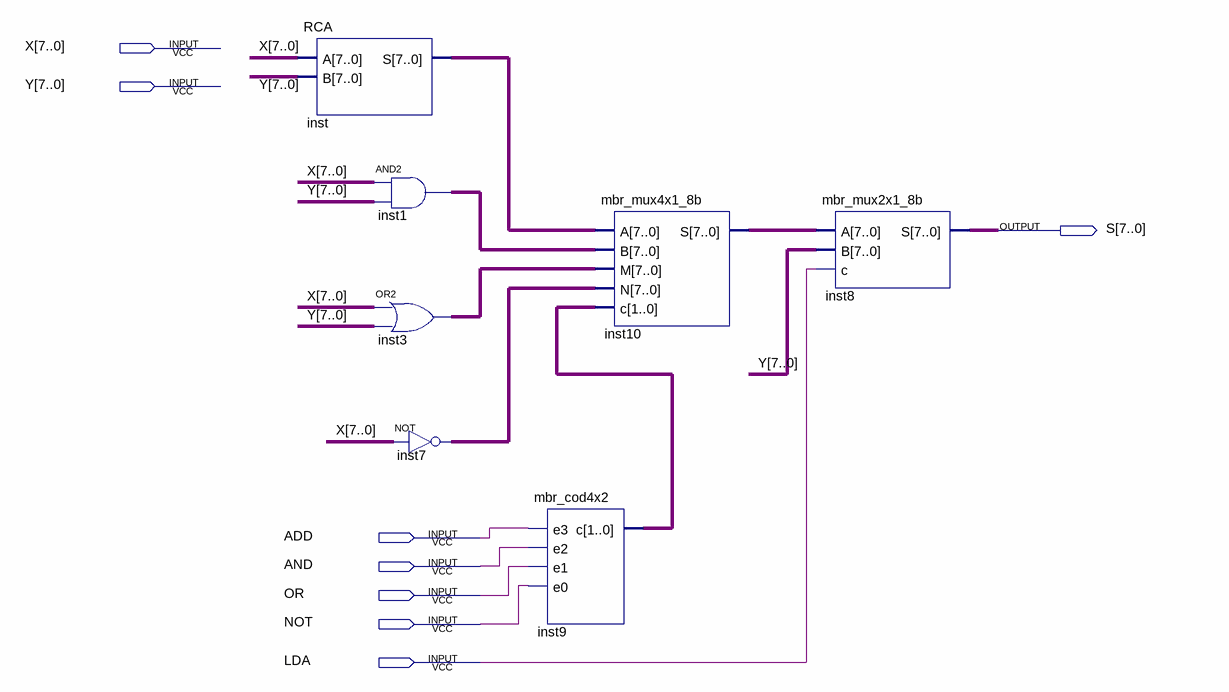
[diagram p0: schematic sheet]
// Quartus schematic mbr_ula.bdf as structural Verilog: 7 symbols, 8 pins
module mbr_ula (
  input  [7:0] X,
  input  [7:0] Y,
  input  ADD,
  input  AND,
  input  OR,
  input  NOT,
  input  LDA,
  output [7:0] S
);

  wire [1:0] inst9_c;
  wire [7:0] inst1_out, inst3_out, inst7_out, inst10_s, inst_s;

  RCA inst (.A(X), .B(Y), .S(inst_s));
  assign inst1_out = X & Y;  // AND2 inst1, 8 bits wide
  assign inst3_out = X | Y;  // OR2 inst3, 8 bits wide
  assign inst7_out = ~X;  // NOT inst7, 8 bits wide
  mbr_cod4x2 inst9 (.e3(ADD), .e2(AND), .e1(OR), .e0(NOT), .c(inst9_c));
  mbr_mux4x1_8b inst10 (.A(inst_s), .B(inst1_out), .M(inst3_out), .N(inst7_out), .c(inst9_c), .S(inst10_s));
  mbr_mux2x1_8b inst8 (.A(inst10_s), .B(Y), .c(LDA), .S(S));
endmodule
